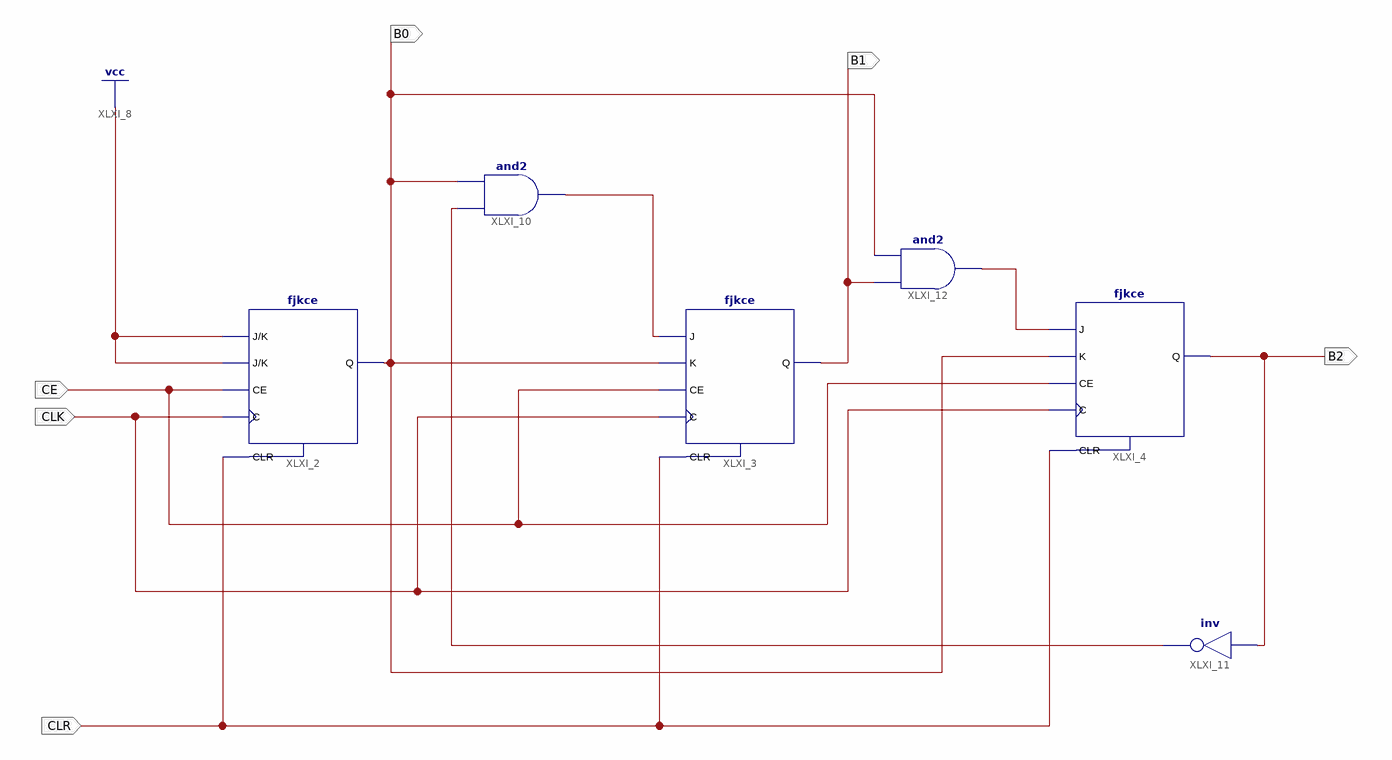
[diagram p0: schematic sheet 1]
// Xilinx ISE schematic Countermod6.sch (spartan6) as structural Verilog: 6 symbols, 6 ports
module Countermod6 (
  input  CE,
  input  CLK,
  input  CLR,
  output B0,
  output B2,
  output B1
);

  wire XLXN_9, XLXN_15, XLXN_18;

  fjkce XLXI_2 (.C(CLK), .CE(CE), .CLR(CLR), .J(1'b1), .K(1'b1), .Q(B0));
  fjkce XLXI_3 (.C(CLK), .CE(CE), .CLR(CLR), .J(XLXN_9), .K(B0), .Q(B1));
  fjkce XLXI_4 (.C(CLK), .CE(CE), .CLR(CLR), .J(XLXN_18), .K(B0), .Q(B2));
  and XLXI_10 (XLXN_9, XLXN_15, B0);
  not XLXI_11 (XLXN_15, B2);
  and XLXI_12 (XLXN_18, B1, B0);
endmodule
